# EAGLE schematic voltage-test (EAGLE 9.1.0)
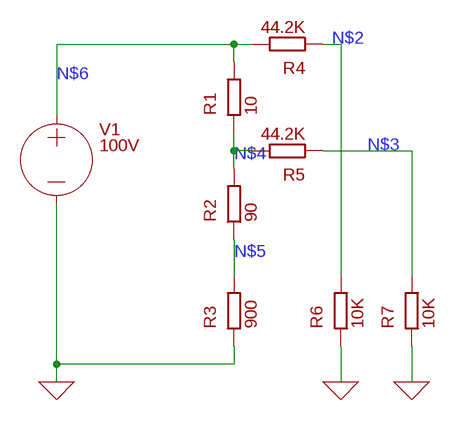
[diagram p0: schematic, sheet 1]

## Parts
R1  10  R  (no package)
R2  90  R  (no package)
R3  900  R  (no package)
R4  44.2K  R  (no package)
R5  44.2K  R  (no package)
R6  10K  R  (no package)
R7  10K  R  (no package)
V1  100V  VOLTAGE  (no package)

## Nets
0: R3.1 R6.1 R7.1 V1.- ; supply symbol labelled GND
N$2: R4.1 R6.2
N$3: R5.1 R7.2
N$4: R1.1 R2.2 R5.2
N$5: R2.1 R3.2
N$6: R1.2 R4.2 V1.+

## Library data of the parts
R1-R7 = ngspice-simulation:R: RESISTOR
V1 = ngspice-simulation:VOLTAGE: Independent Voltage Source, either DC, AC, PULSE, SINE, PWL, EXP, or SFFM; VALUE: 0V